# EAGLE design Luminode_Panel_Mark_II (EAGLE 6.6.0)
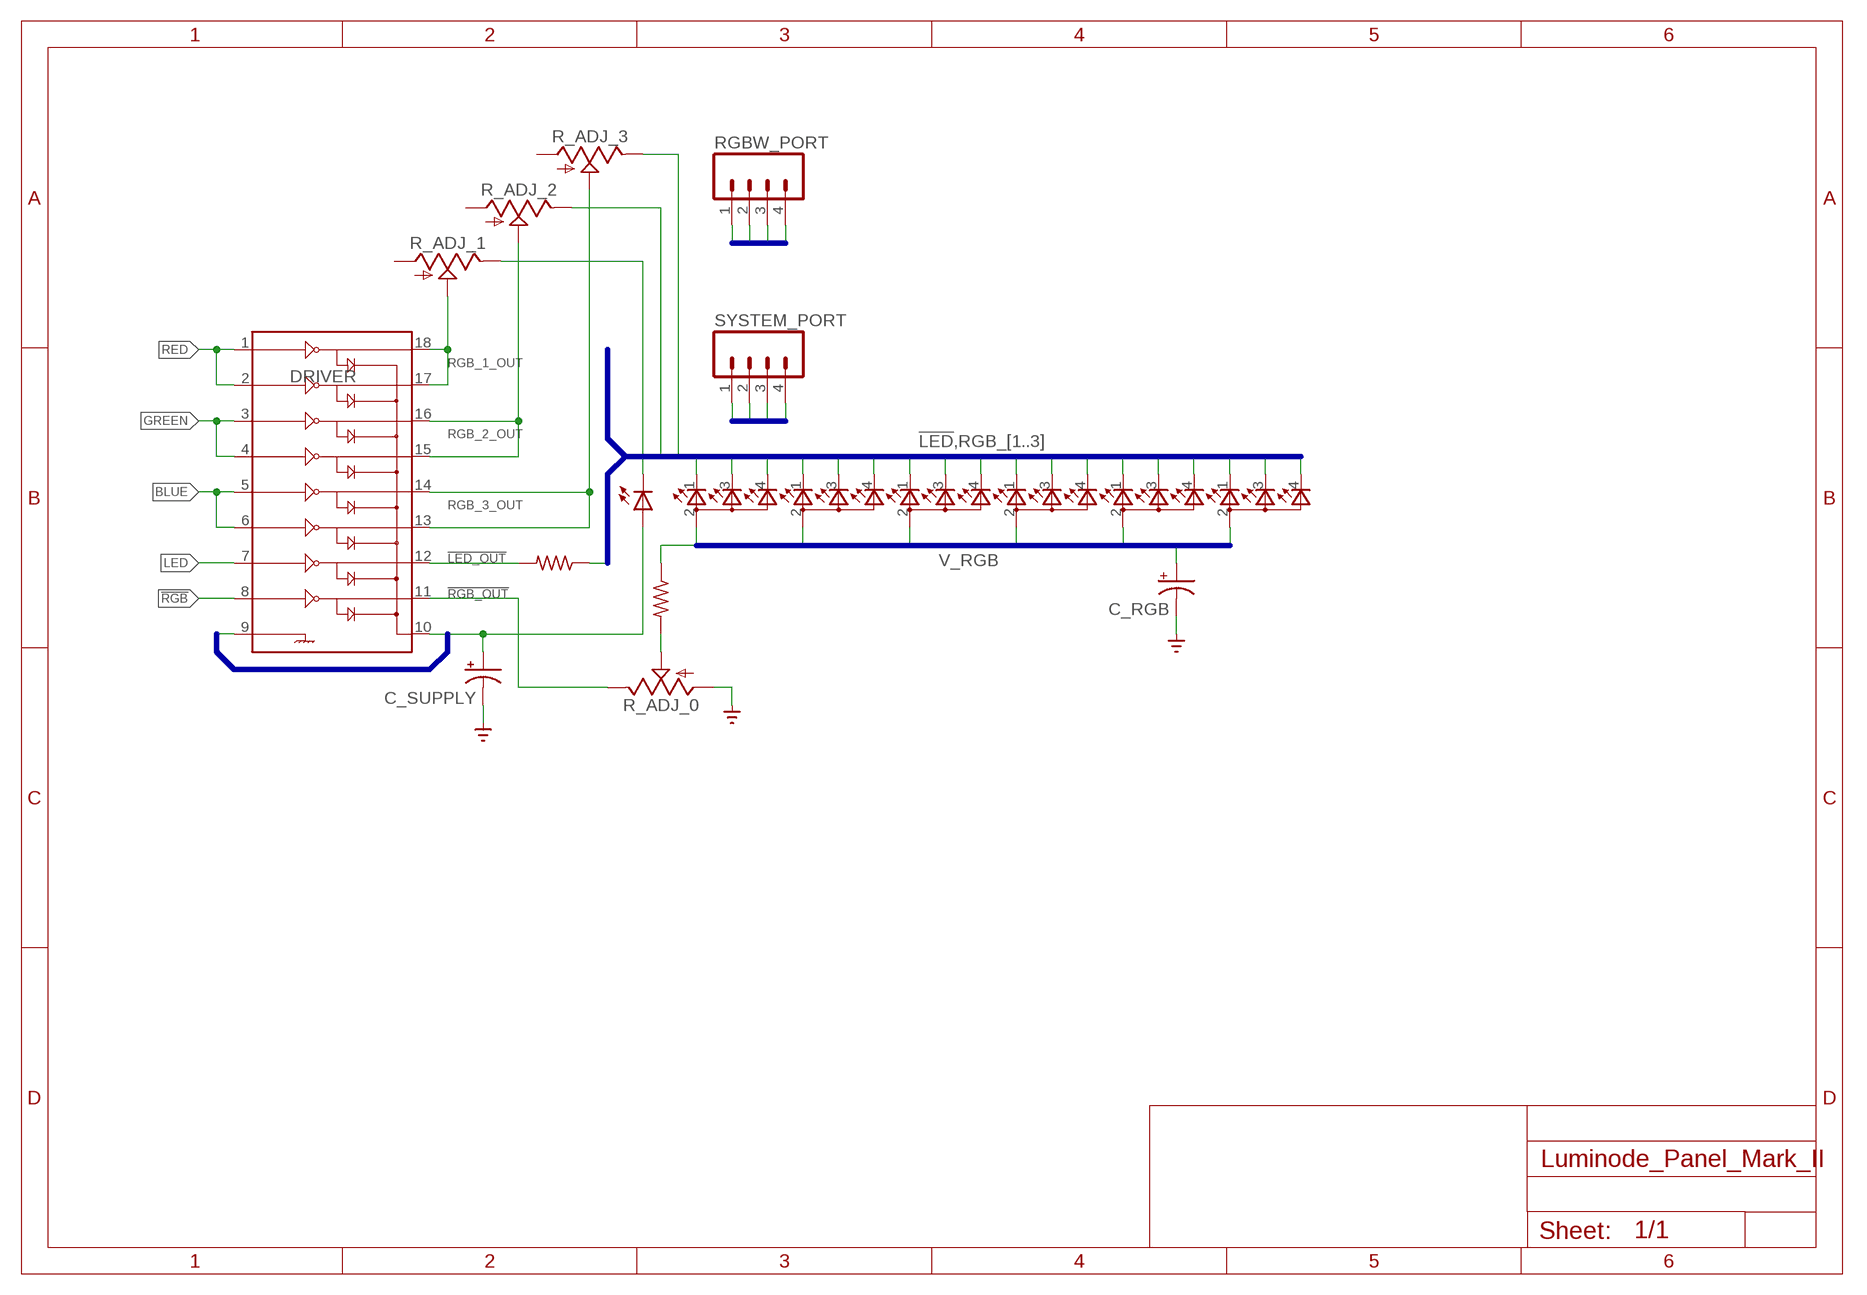
[diagram p0: schematic, sheet 1]

## Parts
C_RGB  CPOL-USE2.5-6  [E2,5-6]
C_SUPPLY  CPOL-USE2.5-6  [E2,5-6]
DRIVER  ULN2803SOICW  [SO18L]
LED  X42180  [Z-POWER-LED-DOME-TYPE]
LED_RGB_1  TOPLED-3PLCC  [P-LCC-4-3]
LED_RGB_2  TOPLED-3PLCC  [P-LCC-4-3]
LED_RGB_3  TOPLED-3PLCC  [P-LCC-4-3]
LED_RGB_4  TOPLED-3PLCC  [P-LCC-4-3]
LED_RGB_5  TOPLED-3PLCC  [P-LCC-4-3]
LED_RGB_6  TOPLED-3PLCC  [P-LCC-4-3]
R_ADJ_0  500E  TRIM_US-B25P  [B25P]
R_ADJ_1  500E  TRIM_US-B25P  [B25P]
R_ADJ_2  500E  TRIM_US-B25P  [B25P]
R_ADJ_3  500E  TRIM_US-B25P  [B25P]
R_LED  R-US_0309/10  [0309/10]
R_RGB  R-US_0207/7  [0207/7]
RGBW_PORT  M04PTH  [1X04]
SYSTEM_PORT  M04PTH  [1X04]

## Nets
5V: SYSTEM_PORT.1
!LED: LED.C R_LED.1
!LED_OUT: DRIVER.12 R_LED.2
!RGB: DRIVER.8 SYSTEM_PORT.4
!RGB_OUT: DRIVER.11 R_ADJ_0.E
BLUE: DRIVER.5 DRIVER.6 RGBW_PORT.3
GND: C_RGB.- C_SUPPLY.- DRIVER.9 R_ADJ_0.A SYSTEM_PORT.3
GREEN: DRIVER.3 DRIVER.4 RGBW_PORT.2
LED: DRIVER.7 RGBW_PORT.4
N$1: R_ADJ_0.S R_RGB.2
RED: DRIVER.1 DRIVER.2 RGBW_PORT.1
RGB_1: LED_RGB_1.1(CRED) LED_RGB_2.1(CRED) LED_RGB_3.1(CRED) LED_RGB_4.1(CRED) LED_RGB_5.1(CRED) LED_RGB_6.1(CRED) R_ADJ_1.E
RGB_1_OUT: DRIVER.17 DRIVER.18 R_ADJ_1.S
RGB_2: LED_RGB_1.3(CBLUE) LED_RGB_2.3(CBLUE) LED_RGB_3.3(CBLUE) LED_RGB_4.3(CBLUE) LED_RGB_5.3(CBLUE) LED_RGB_6.3(CBLUE) R_ADJ_2.E
RGB_2_OUT: DRIVER.15 DRIVER.16 R_ADJ_2.S
RGB_3: LED_RGB_1.4(CGREEN) LED_RGB_2.4(CGREEN) LED_RGB_3.4(CGREEN) LED_RGB_4.4(CGREEN) LED_RGB_5.4(CGREEN) LED_RGB_6.4(CGREEN) R_ADJ_3.E
RGB_3_OUT: DRIVER.13 DRIVER.14 R_ADJ_3.S
V_RGB: C_RGB.+ LED_RGB_1.2(A2) LED_RGB_2.2(A2) LED_RGB_3.2(A2) LED_RGB_4.2(A2) LED_RGB_5.2(A2) LED_RGB_6.2(A2) R_RGB.1
VIN: C_SUPPLY.+ DRIVER.10 LED.A SYSTEM_PORT.2
Unconnected: R_ADJ_1.A R_ADJ_2.A R_ADJ_3.A

## Buses
!LED,RGB_[1..3]
VIN,GND
V_RGB
RED,GREEN,BLUE,LED
VIN,5V,GND,!RGB

## Library data of the parts
C_RGB C_SUPPLY = rcl:CPOL-US: POLARIZED CAPACITOR, American symbol
DRIVER = SparkFun:ULN2803: Darlington Driver ULN2803 Darlington array. 500mA max per channel, 8-channel package. Spark Fun Electronics SKU : COM-00312
LED = led:X42180: Z-Power LED P4 Series, Dome type Source: http://www.seoulsemicon.co.kr .. X42180.pdf
LED_RGB_1-LED_RGB_6 = Spark:TOPLED-3: Cree CLVBA-FKA
R_ADJ_0 R_ADJ_1-R_ADJ_3 = pot:TRIM_US-: POTENTIOMETER
R_LED R_RGB = rcl:R-US_: RESISTOR, American symbol
RGBW_PORT SYSTEM_PORT = SparkFun:M04: Header 4 Standard 4-pin 0.1" header. Use with straight break away headers (SKU : PRT-00116), right angle break away headers (PRT-00553), swiss pins (PRT-00743), machine pins (PRT-00117), and female headers (PRT-00115). Molex polarized connector foot print use with SKU : PRT-08231 with associated crimp pins and housings.

## Net classes
0 default: width 0.61 mm, drill 0.813 mm, clearance 0.508 mm
1 HIGH CURRENT: width 0.61 mm, clearance 0.61 mm
3 SUPPLY: width 0.813 mm, drill 0.61 mm, clearance 0.61 mm

## Board
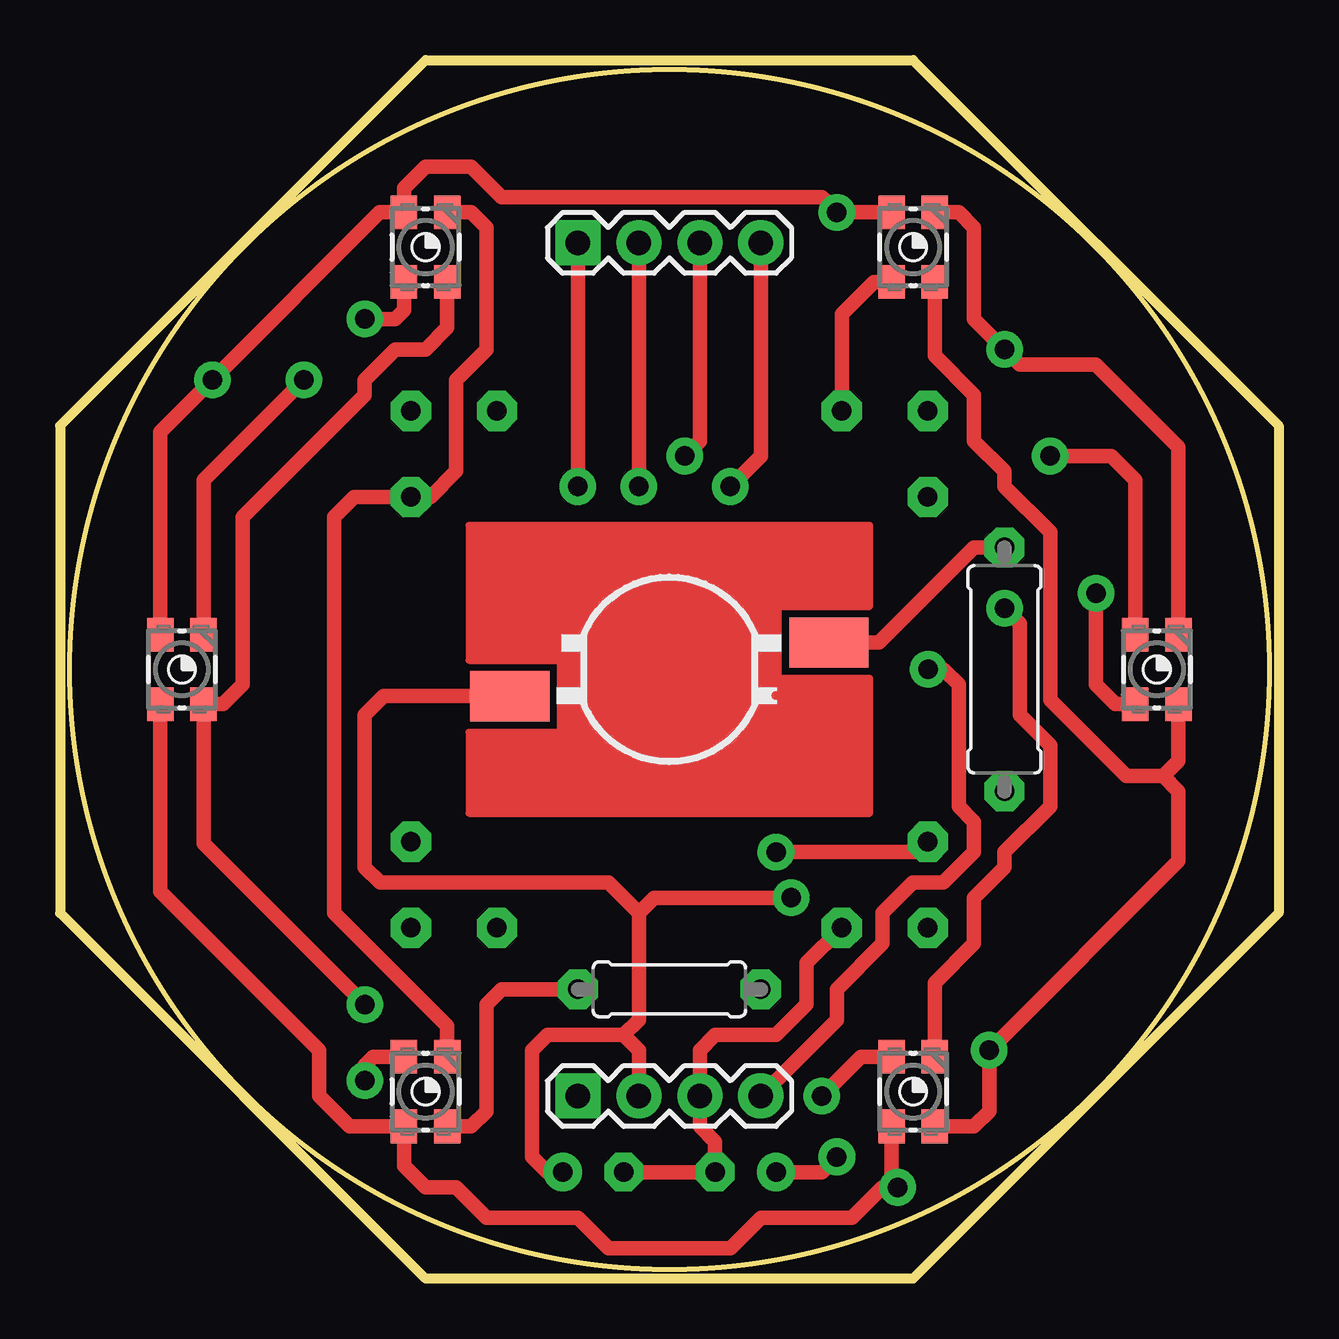
[diagram p1: board, top side]
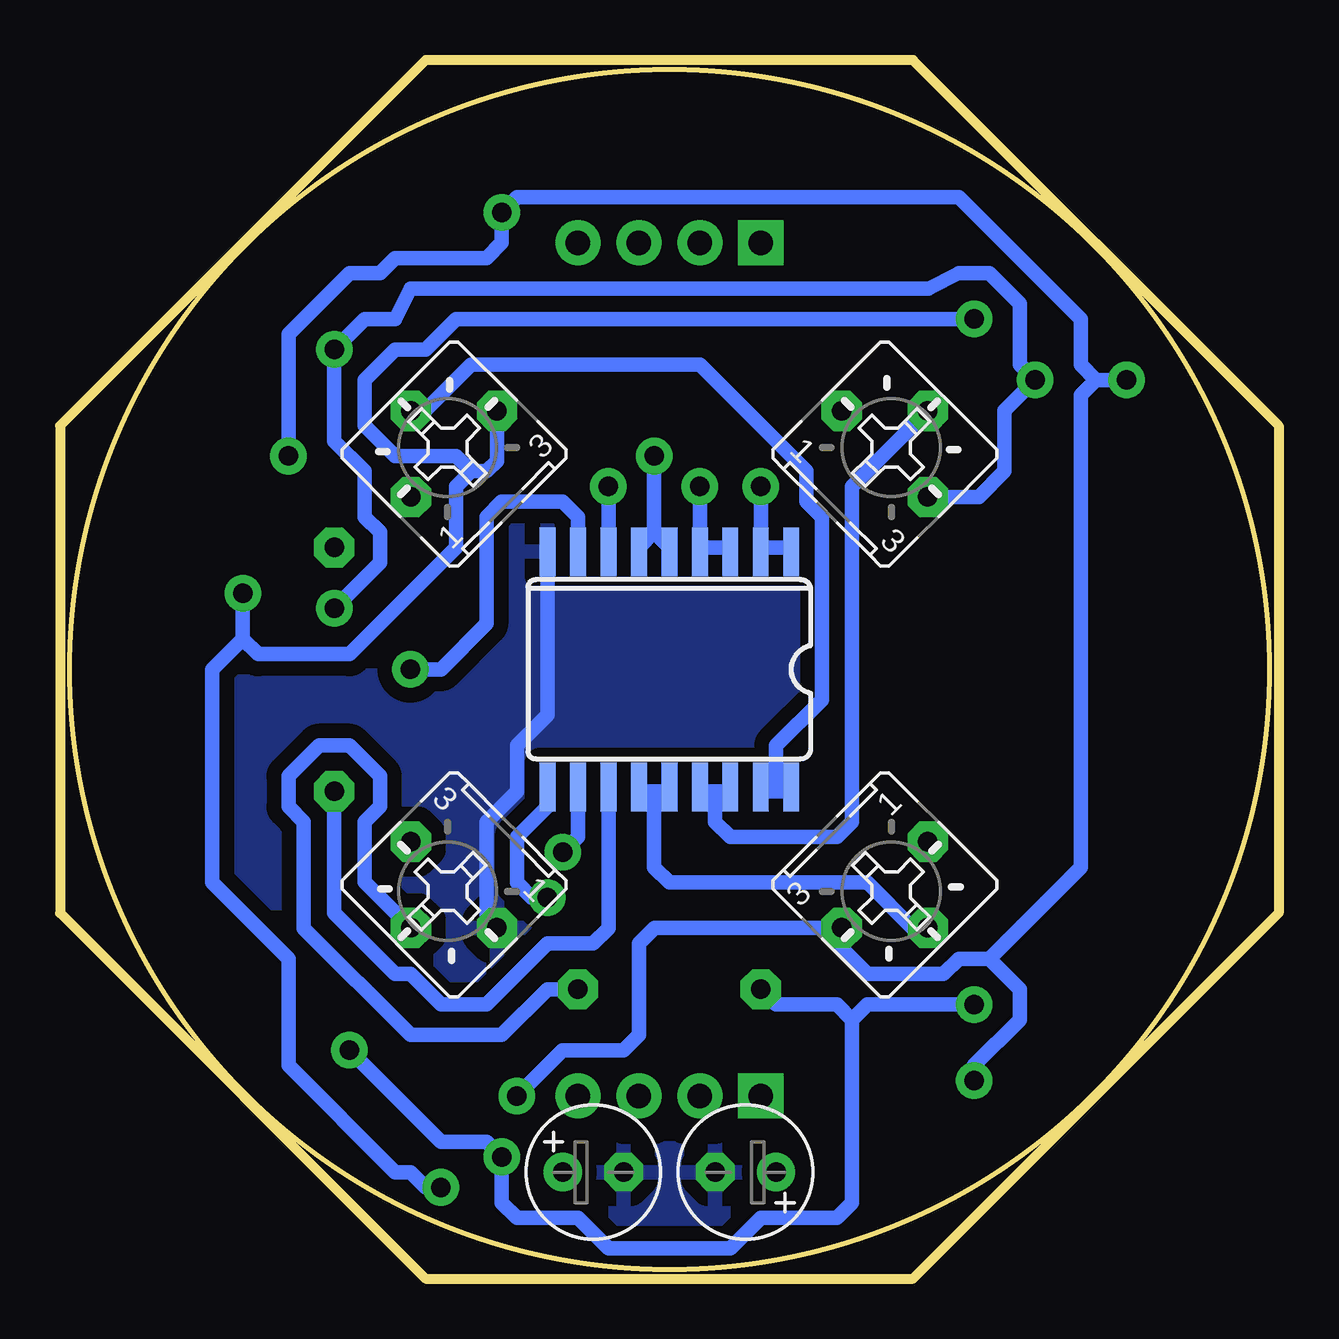
[diagram p2: board, bottom side, seen from below]

Size 50.8 x 50.8 mm. Coordinates in mm from the lower left corner, seen from the top.
Outline: 0,35.56 0,15.24 15.24,0 35.56,0 50.8,15.24 50.8,35.56 35.56,50.8 15.24,50.8 0,35.56
Outline: circle at 25.4,25.4 radius 25
Copper layers (1*16): Top 0.035mm / dielectric 1.5mm / Bottom 0.035mm
Design rules "Luminode *": minimum track width 24mil, minimum drill 24mil, track to track 20mil, track to pad 20mil, pad to pad 20mil, via to via 20mil, smd to smd 8mil, copper to edge 24mil, drill to drill 24mil, minimum pad ring 10mil, minimum via ring 8mil, stop-mask expansion 4mil, vias tented up to drill 0mil, thermal gap 24mil
bRestrict: area 20.3,41.9 to 30.5,44.5; area 20.3,6.3 to 30.5,8.9

### Footprints (pad centres in the part's own frame; a part is rotated, then mirrored left to right if it is on the bottom)
E2,5-6 = drill 0.813 pad 1.6: + -1.27,0 | drill 0.813 pad 1.6 octagon: - 1.27,0
SO18L = smd 0.66 x 2.032: 1 -5.08,-4.902; 2 -3.81,-4.902; 3 -2.54,-4.902; 4 -1.27,-4.902; 5 0,-4.902; 6 1.27,-4.902; 7 2.54,-4.902; 8 3.81,-4.902; 9 5.08,-4.902; 10 5.08,4.902; 11 3.81,4.902; 12 2.54,4.902; 13 1.27,4.902; 14 0,4.902; 15 -1.27,4.902; 16 -2.54,4.902; 17 -3.81,4.902; 18 -5.08,4.902
Z-POWER-LED-DOME-TYPE = smd 3.3 x 2.1: A -6.65,-1.12; C 6.65,1.12
P-LCC-4-3 = smd 1.1 x 1.4: 1 -0.9,-1.45; 2 0.9,-1.45; 3 0.9,1.45; 4 -0.9,1.45
B25P = drill 0.813 pad 1.676 octagon: A -2.54,0; E 2.54,0; S 0,2.54
0309/10 = drill 0.813 pad 1.676 octagon: 1 -5.08,0; 2 5.08,0
0207/7 = drill 0.813 pad 1.676 octagon: 1 -3.81,0; 2 3.81,0
1X04 = drill 1.016 pad 1.88 square: 1 0,0 | drill 1.016 pad 1.88: 2 2.54,0; 3 5.08,0; 4 7.62,0

### Placement (x,y rotation side)
C_RGB  28.57,4.45 0 bottom
C_SUPPLY  22.22,4.45 180 bottom
DRIVER  25.4,25.4 180 bottom
LED  25.4,25.4 0 top
LED_RGB_1  45.72,25.4 0 top
LED_RGB_2  35.56,43 0 top
LED_RGB_3  15.24,43 0 top
LED_RGB_4  5.08,25.4 0 top
LED_RGB_5  15.24,7.8 0 top
LED_RGB_6  35.56,7.8 0 top
R_ADJ_0  34.38,16.42 135 bottom
R_ADJ_1  34.38,34.38 45 bottom
R_ADJ_2  16.42,34.38 315 bottom
R_ADJ_3  16.42,16.42 225 bottom
R_LED  39.37,25.4 270 top
R_RGB  25.4,12.06 0 top
RGBW_PORT  21.59,43.18 0 top
SYSTEM_PORT  21.59,7.62 0 top

### Tracks (layer width: path | path; a pad name or v marks a point on that pad's centre or on a via)
!LED
  Top 0.61: R_LED.1 38.1,30.48 34.14,26.52 LED.C
!LED_OUT
  Bottom 0.61: R_LED.2 39.37,15.24 36.83,12.7 36.2,12.7 34.92,11.43 33.02,11.43 30.48,13.97 28.57,13.97 27.94,14.6 DRIVER.12
!RGB  (via drill 0.81 pad 1.52)
  Top 0.61: SYSTEM_PORT.4 32.38,10.79 32.38,12.06 34.29,13.97 34.29,15.24 35.56,16.51 36.83,16.51 38.1,17.78 38.1,19.05 37.46,19.68 37.46,24.76 36.83,25.4 v36.2,25.4
  Bottom 0.61: DRIVER.8 29.21,31.75 29.84,32.38 32.38,32.38 33.02,31.75 33.02,27.3 34.92,25.4 v36.2,25.4
!RGB_OUT  (via drill 0.81 pad 1.52)
  Top 0.61: v29.84,17.78 35.74,17.78 R_ADJ_0.E
  Bottom 0.61: DRIVER.11 29.21,18.41 v29.84,17.78
BLUE  (via drill 0.81 pad 1.52)
  Top 0.61: RGBW_PORT.3 26.67,34.92 v26.04,34.29
  Bottom 0.61: 26.04,31.11 v26.04,34.29 | 26.04,31.11 25.4,30.48 DRIVER.5 | 26.04,31.11 26.67,30.48 DRIVER.6
GND
  Top 0.61: C_SUPPLY.- C_RGB.- 27.3,5.71 26.67,6.35 SYSTEM_PORT.3 26.67,9.52 27.3,10.16 29.84,10.16 31.11,11.43 31.11,13.15 R_ADJ_0.A
  Bottom 0.61: DRIVER.9 30.48,23.49 31.75,22.22 31.75,20.32 33.02,19.05 33.02,15.06 R_ADJ_0.A
  pour Bottom (isolate 0.61): 0,35.56 15.24,50.8 35.56,50.8 50.8,35.56 50.8,15.24 35.56,0 15.24,0 0,15.24
GREEN  (via drill 0.81 pad 1.52)
  Top 0.61: v24.13,33.02 RGBW_PORT.2
  Bottom 0.61: 24.13,30.48 v24.13,33.02 | 24.13,30.48 22.86,30.48 DRIVER.3 | 24.13,30.48 DRIVER.4
LED  (via drill 0.81 pad 1.52)
  Top 0.61: RGBW_PORT.4 29.21,34.29 v27.94,33.02
  Bottom 0.61: DRIVER.7 v27.94,33.02
N$1
  Bottom 0.61: R_RGB.2 30.48,12.06 32.38,10.16 36.2,10.16 40.64,14.6 40.64,19.05 41.27,19.68 41.27,20.95 40,22.22 38.73,22.22 37.46,20.95 37.46,19.68 38.1,19.05 38.1,16.55 R_ADJ_0.S
RED  (via drill 0.81 pad 1.52)
  Top 0.61: v21.59,33.02 RGBW_PORT.1
  Bottom 0.61: 21.59,30.48 v21.59,33.02 | 21.59,30.48 20.32,30.48 DRIVER.1 | 21.59,30.48 DRIVER.2
RGB_1  (via drill 0.81 pad 1.52)
  Top 0.61: v43.18,28.57 43.18,24.76 43.99,23.95 LED_RGB_1.1 | LED_RGB_2.1 33.93,41.55 32.58,40.2 R_ADJ_1.E | v12.7,40 13.97,40 14.34,40.38 LED_RGB_3.1 | LED_RGB_4.1 4.18,16.14 10.79,9.52 10.79,7.62 12.06,6.35 12.07,6.35 LED_RGB_5.1 14.34,4.71 15.24,3.81 16.51,3.81 17.78,2.54 21.59,2.54 22.86,1.27 27.94,1.27 29.21,2.54 33.02,2.54 34.29,3.81 v34.92,3.81 34.66,4.07 LED_RGB_6.1
  Bottom 0.61: v12.7,40 34.29,40 35.56,38.73 36.83,38.73 38.1,37.46 38.1,35.56 36.83,34.29 34.29,34.29 33.66,33.66 | v34.92,3.81 35.56,3.81 36.2,4.45 36.83,4.45 41.27,8.89 41.27,13.33 44.45,16.51 44.45,25.4 43.18,26.67 | 33.66,33.66 34.29,33.02 34.29,30.48 38.73,26.04 42.55,26.04 43.18,26.67 | 33.66,33.66 33.02,33.66 32.58,34.09 R_ADJ_1.E | v43.18,28.57 43.18,26.67
RGB_1_OUT
  Bottom 0.61: 20.32,20.95 DRIVER.18 20.32,20.32 20.95,20.32 | 20.95,20.32 21.59,20.32 DRIVER.17 | 20.95,20.32 20.95,22.22 19.05,24.13 19.05,31.75 19.68,32.38 19.68,33.66 24.13,38.1 33.66,38.1 35.58,36.18 R_ADJ_1.S
RGB_2  (via drill 0.81 pad 1.52)
  Top 0.61: v10.16,37.46 5.98,33.28 LED_RGB_4.3 | v39.37,27.94 40,27.3 40,23.49 41.27,22.22 41.27,19.68 39.37,17.78 39.37,17.14 38.1,15.87 38.1,13.97 36.46,12.33 LED_RGB_6.3 | LED_RGB_1.3 46.62,34.66 43.18,38.1 40,38.1 v39.37,38.73 38.1,40 38.1,43.81 37.47,44.45 LED_RGB_2.3 | LED_RGB_5.3 16.14,10.53 11.43,15.24 11.43,31.75 12.26,32.58 R_ADJ_2.E 15.44,32.58 16.51,33.66 16.51,37.46 17.78,38.73 17.78,43.81 17.14,44.45 LED_RGB_3.3
  Bottom 0.61: v39.37,27.94 37.46,29.84 37.46,31.11 38.1,31.75 38.1,33.66 39.37,34.92 v39.37,38.73 38.1,40 36.83,40 36.2,41.27 14.6,41.27 13.33,41.91 12.06,41.91 10.79,40.64 10.79,38.1 v10.16,37.46 11.43,36.2 11.43,33.66 12.5,32.58 R_ADJ_2.E
RGB_2_OUT
  Bottom 0.61: 23.49,20.32 22.86,20.32 DRIVER.16 | 23.49,20.32 24.13,20.32 DRIVER.15 | 23.49,20.32 23.49,19.05 22.86,18.41 18.41,18.41 17.78,19.05 17.78,33.02 R_ADJ_2.S
RGB_3  (via drill 0.81 pad 1.52)
  Top 0.61: LED_RGB_5.4 13.06,9.25 12.7,8.89 v12.7,8.25 | LED_RGB_6.4 33.38,9.25 v31.75,7.62 | LED_RGB_4.4 4.18,35.3 v6.35,37.46 13.33,44.45 LED_RGB_3.4 14.34,45.45 15.24,46.35 17.14,46.35 18.41,45.08 31.75,45.08 v32.38,44.45 v32.39,44.45 LED_RGB_2.4 | v41.27,34.29 43.81,34.29 44.82,33.28 LED_RGB_1.4
  Bottom 0.61: v12.7,8.25 12.7,8.89 10.79,10.79 10.79,12.06 12.06,13.33 | 12.06,13.33 13.33,13.33 13.97,12.7 17.14,12.7 18.22,13.77 R_ADJ_3.E 26.02,14.62 26.67,13.97 26.67,10.16 27.3,9.52 29.84,9.52 v31.75,7.62 | v41.27,34.29 41.27,39.37 38.73,41.91 37.46,41.91 36.83,42.55 33.02,42.55 32.38,43.18 v32.38,44.45 31.75,45.08 13.33,45.08 8.25,40 8.25,38.1 7.62,37.46 | 12.06,13.33 8.25,17.14 8.25,36.83 7.62,37.46 | v6.35,37.46 7.62,37.46
RGB_3_OUT
  Bottom 0.61: 26.04,20.32 25.4,20.32 DRIVER.14 | 26.04,20.32 26.67,20.32 DRIVER.13 | 26.04,20.32 26.04,17.14 25.4,16.51 17.14,16.51 15.26,14.62 R_ADJ_3.S
V_RGB  (via drill 0.81 pad 1.52)
  Top 0.61: v12.7,11.43 5.98,18.15 LED_RGB_4.2 6.8,23.95 7.62,24.76 7.62,31.75 12.7,36.83 12.7,37.46 13.97,38.73 15.24,38.73 16.14,39.63 LED_RGB_3.2 | R_RGB.1 18.41,12.06 17.78,11.43 17.78,6.98 17.14,6.35 LED_RGB_5.2 | C_RGB.+ 31.75,4.45 v32.38,5.08 | 45.98,20.95 44.45,20.95 41.27,24.13 41.27,31.11 39.37,33.02 39.37,33.66 38.1,34.92 38.1,36.83 36.46,38.47 LED_RGB_2.2 | 45.98,20.95 46.62,21.59 LED_RGB_1.2 | 45.98,20.95 46.62,20.32 46.62,17.41 v38.73,9.52 38.73,6.98 38.1,6.35 LED_RGB_6.2
  Bottom 0.61: v38.73,9.52 34.92,5.71 33.02,5.71 v32.38,5.08 32.38,3.17 31.75,2.54 29.21,2.54 27.94,1.27 22.86,1.27 21.59,2.54 18.41,2.54 17.78,3.17 17.78,10.79 | R_RGB.1 20.95,11.43 18.41,11.43 17.78,10.79 | v12.7,11.43 17.14,11.43 17.78,10.79
VIN  (via drill 0.81 pad 1.52)
  Top 0.61: 24.13,15.24 24.13,10.79 23.49,10.16 | v30.48,15.87 24.76,15.87 24.13,15.24 | 24.13,15.24 22.86,16.51 13.33,16.51 12.7,17.14 12.7,23.49 13.48,24.28 LED.A | C_SUPPLY.+ 20.32,4.45 19.68,5.08 19.68,9.52 20.32,10.16 23.49,10.16 | SYSTEM_PORT.2 24.13,9.52 23.49,10.16
  Bottom 0.61: DRIVER.10 30.48,19.68 31.75,18.41 31.75,16.51 31.11,15.87 v30.48,15.87